# Altium schematic sheet KeyPad.SchDoc
size A; SheetNumber: 10; SheetTotal: 12
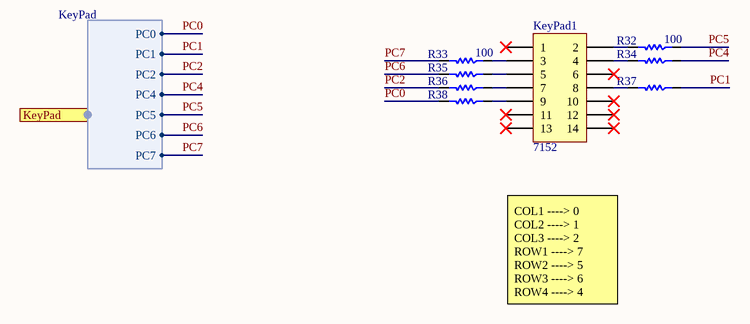
[diagram p0: KeyPad.SchDoc]

## Parts
KeyPad1  Inflow: 7152  [HDR_THT_7x2M_2.54mm]  (hidden comment: 7x2)
R32  100  [RES 1206 (3216X08L)]
R33  100  [RES 1206 (3216X08L)]
R34  10K  [RES 1206 (3216X08L)]  (value not drawn)
R35  10K  [RES 1206 (3216X08L)]  (value not drawn)
R36  10K  [RES 1206 (3216X08L)]  (value not drawn)
R37  10K  [RES 1206 (3216X08L)]  (value not drawn)
R38  10K  [RES 1206 (3216X08L)]  (value not drawn)

## Ports
KeyPad (harness KeyPad)

## Harnesses
KeyPad: PC0, PC1, PC2, PC4, PC5, PC6, PC7

## Nets
PC0: R38.2 ; port KeyPad.PC0
PC1: R37.1 ; port KeyPad.PC1
PC2: R36.2 ; port KeyPad.PC2
PC4: R34.1 ; port KeyPad.PC4
PC5: R32.1 ; port KeyPad.PC5
PC6: R35.2 ; port KeyPad.PC6
PC7: R33.2 ; port KeyPad.PC7
NetKeyPad1_2: KeyPad1.2 R32.2
NetKeyPad1_3: KeyPad1.3 R33.1
NetKeyPad1_4: KeyPad1.4 R34.2
NetKeyPad1_5: KeyPad1.5 R35.1
NetKeyPad1_7: KeyPad1.7 R36.1
NetKeyPad1_8: KeyPad1.8 R37.2
NetKeyPad1_9: KeyPad1.9 R38.1

Not connected (* = marked no-connect by the designer): KeyPad1 1* 6* 10* 11* 12* 13* 14*

## Notes on the sheet
- COL1 ----> 0
  COL2 ----> 1
  COL3 ----> 2
  ROW1 ----> 7
  ROW2 ----> 5
  ROW3 ----> 6
  ROW4 ----> 4

## Library data of the parts
KeyPad1 = Con_MPH_7x2_V_THT_2.54: Header, dual row, 14 pin; Rating: Rating?; Validation: NT; Value: 7x2; Package: Package?; Type: Type?
R32-R38 = Res_SMD_1206: Resistor; Inflow: inflow?; Rating: 0.25W; Validation: Valid; Package: 1206; Type: 10%
  R32 R33: Value: 100
  R34-R38: Value: 10K